# EAGLE design Useless USB Gift Board (EAGLE 7.6.0)
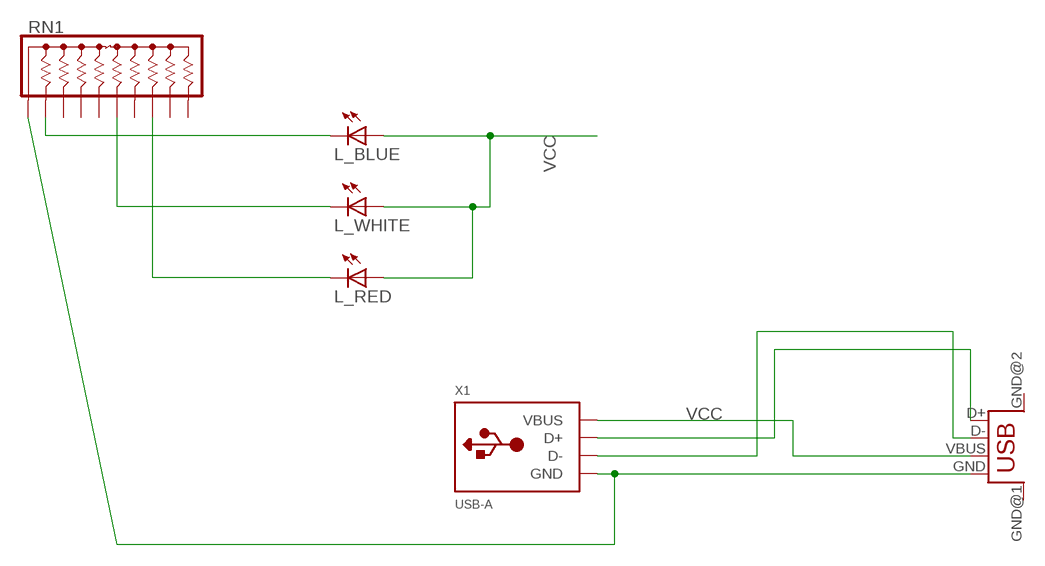
[diagram p0: schematic, sheet 1]

## Parts
L_BLUE  LED5MM  [LED5MM]
L_RED  LED5MM  [LED5MM]
L_WHITE  LED5MM  [LED5MM]
RN1  4610X  [SIP10]
U$1  USB  [USB-FEMALE-A-PTH]
X1  USB-A  [MOLEX_480371000]

## Nets
N$1: RN1.1 U$1.GND X1.4(GND)
N$2: L_BLUE.K(C) RN1.2
N$3: U$1.D+ X1.3(D+)
N$4: U$1.D- X1.2(D-)
N$5: L_RED.K(C) RN1.8
N$6: L_WHITE.K(C) RN1.6
VCC: L_BLUE.A L_RED.A L_WHITE.A U$1.VBUS X1.1(VBUS)
Unconnected: RN1.3 RN1.4 RN1.5 RN1.7 RN1.9 RN1.10 U$1.GND@1(GND) U$1.GND@2(GND)

## Library data of the parts
L_BLUE L_RED L_WHITE = adafruit:LED: LED OSRAM: - CHIPLED LG R971, LG N971, LY N971, LG Q971, LY Q971, LO R971, LY R971 LH N974, LH R974 LS Q976, LO Q976, LY Q976 LO Q996 - Hyper CHIPLED LW Q18S LB Q993, LB Q99A, LB R99A - SideLED LS A670, LO A670, LY A670, LG A670, LP A670 LB A673, LV A673, LT A673, LW A673 LH A674 LY A675 LS A676, LA A676, LO A676, LY A676, LW A676 LS A679, LY A679, LG A679 - Hyper Micro SIDELED® LS Y876, LA Y876, LO Y876, LY Y876 LT Y87S - SmartLED LW L88C, LW L88S LB L89C, LB L89S, LG L890 LS L89K, LO L89K, LY L89K LS L896, LA L896, LO L896, LY L896 - TOPLED LS T670, LO T670, LY T670, LG T670, LP T670 LSG T670, LSP T670, LSY T670, LOP T670, LYG T670 LG T671, LOG T671, LSG T671 LB T673, LV T673, LT T673, LW T673 LH T674 LS T676, LA T676, LO T676, LY T676, LB T676, LH T676, LSB T676, LW T676 LB T67C, LV T67C, LT T67C, LS T67K, LO T67K, LY T67K, LW E67C LS E67B, LA E67B, LO E67B, LY E67B, LB E67C, LV E67C, LT E67C LW T67C LS T679, LY T679, LG T679 LS T770, LO T770, LY T770, LG T770, LP T770 LB T773, LV T773, LT T773, LW T773 LH T774 LS E675, LA E675, LY E675, LS T675 LS T776, LA T776, LO T776, LY T776, LB T776 LHGB T686 LT T68C, LB T68C - Hyper Mini TOPLED® LB M676 - Mini TOPLED Santana® LG M470 LS M47K, LO M47K, LY M47K Source: http://www.osram.convergy.de/
RN1 = resistor-sip:4610X: Bourns 4600X Series - Thick Film Conformal SIPs 4610X-101 Resistor Network Configuration: 101 (Bussed Resistors) Resistance range: 10 ohms to 10 Megaohms Maximum Operating Voltage: 100V Source: http://www.bourns.com/ProductLine.aspx?name=standard_thick_film_networks PDF: http://www.bourns.com/data/global/pdfs/4600X.pdf
U$1 = STUNTAZ:USB: USB Connectors USB-FEMALE-A-PTH: Through hole Female Type A Connector
X1 = adafruit:USB-A: USB type A 'plug' Used for things that can directly connect to a USB port, say USB key

## Board
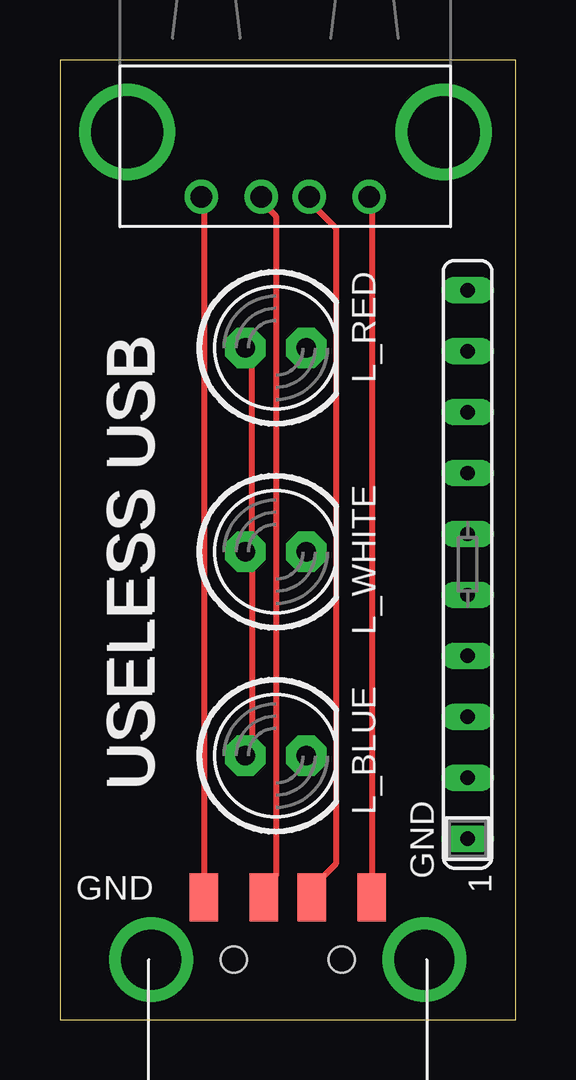
[diagram p1: board, top side]
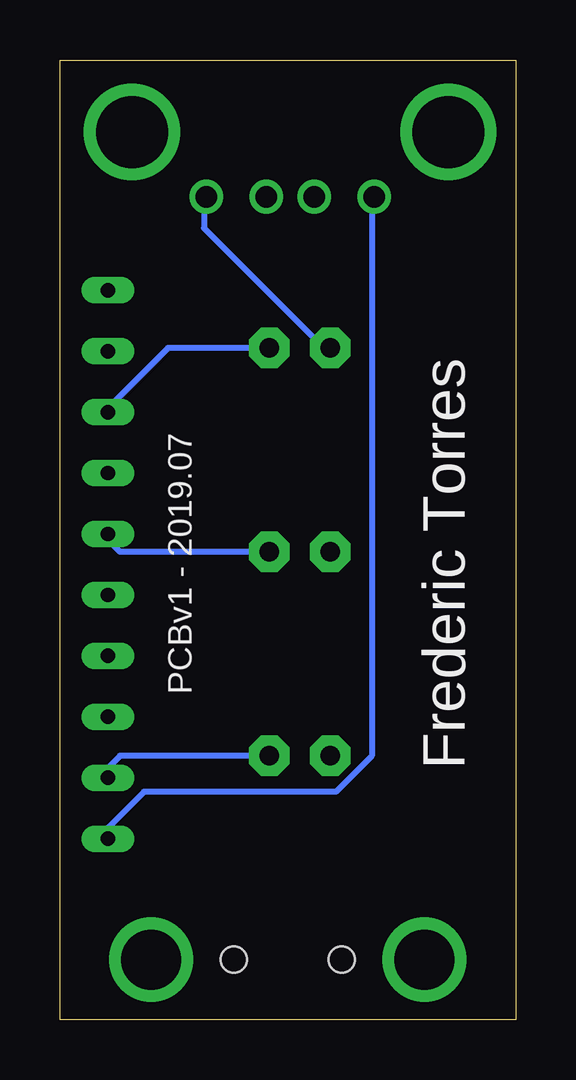
[diagram p2: board, bottom side, seen from below]

Size 19 x 40 mm. Coordinates in mm from the lower left corner, seen from the top.
Outline: 0,0 19,0 19,40 0,40 0,0
Copper layers (1*16): Top 0.035mm / dielectric 1.5mm / Bottom 0.035mm
Design rules "default": minimum track width 10mil, minimum drill 24mil, track to track 8mil, track to pad 8mil, pad to pad 8mil, via to via 8mil, smd to smd 8mil, copper to edge 40mil, drill to drill 8mil, minimum pad ring 10mil, minimum via ring 8mil, stop-mask expansion 4mil, vias tented up to drill 0mil, thermal gap 10mil

### Footprints (pad centres in the part's own frame; a part is rotated, then mirrored left to right if it is on the bottom)
LED5MM = drill 0.813 pad 1.676 octagon: A -1.27,0; K 1.27,0
SIP10 = drill 0.6 long: 1 -11.46,0; 2 -8.92,0; 3 -6.38,0; 4 -3.84,0; 5 -1.3,0; 6 1.24,0; 7 3.78,0; 8 6.32,0; 9 8.86,0; 10 11.4,0
USB-FEMALE-A-PTH = drill 0.9: D+ 5.9,1.3; D- 7.9,1.3; GND 3.4,1.3; VBUS 10.4,1.3 | drill 3: GND@1 13.5,4; GND@2 0.3,4
MOLEX_480371000 = smd 1.2 x 2: 1 3.5,2.6; 2 1,2.6; 3 -1,2.6; 4 -3.5,2.6 | drill 2.5: M1 -5.7,0; M2 5.7,0 | hole 1.1: -2.25,0; 2.25,0

### Placement (x,y rotation side)
L_BLUE  9,11 0 top
L_RED  9,28 0 top
L_WHITE  9,19.5 0 top
RN1  17,19 90 top
U$1  2.5,33 0 top
X1  9.5,2.5 0 top

### Tracks (layer width: path | path; a pad name or v marks a point on that pad's centre or on a via)
N$1
  Top 0.254: X1.4 6,34 U$1.GND
  Bottom 0.254: RN1.1 17,8 15.5,9.5 7.5,9.5 6,11 6,34 U$1.GND
N$2
  Bottom 0.254: L_BLUE.K 16.5,11 17,10.5 RN1.2
N$3
  Top 0.254: X1.3 8.5,5.5 9,6 9,33.5 8.5,34 U$1.D+
N$4
  Top 0.254: X1.2 10.5,5.5 11.5,6.5 11.5,33 10.5,34 U$1.D-
N$5
  Bottom 0.254: L_RED.K 14.5,28 17,25.5 RN1.8
N$6
  Bottom 0.254: L_WHITE.K 16.5,19.5 17,20 RN1.6
VCC
  Top 0.254: 8,19.5 8,11 L_BLUE.A | 8,19.5 8,28 L_RED.A | 8,19.5 L_WHITE.A | X1.1 13,34 U$1.VBUS
  Bottom 0.254: L_RED.A 8,28 13,33 13,34 U$1.VBUS

### Text on the board
tNames: USELESS USB | USELESS USB | GND | GND
bNames: Frederic Torres | PCBv1 - 2019.07